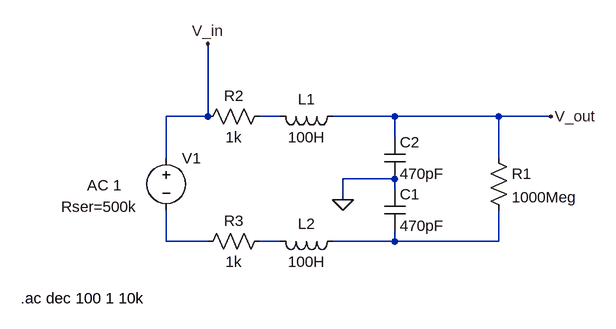
[diagram p0: schematic Filter_LC.asc]
Filter_LC.asc, the LTspice schematic file:
Version 4
SHEET 1 880 680
WIRE -80 96 -80 -16
WIRE -80 96 -144 96
WIRE 32 96 0 96
WIRE 208 96 112 96
WIRE 368 96 208 96
WIRE 448 96 368 96
WIRE 208 128 208 96
WIRE -144 160 -144 96
WIRE 368 160 368 96
WIRE 208 192 128 192
WIRE 208 208 208 192
WIRE 128 224 128 192
WIRE -144 288 -144 240
WIRE -80 288 -144 288
WIRE 32 288 0 288
WIRE 208 288 208 272
WIRE 208 288 112 288
WIRE 368 288 368 240
WIRE 368 288 208 288
FLAG 128 224 0
FLAG 448 96 V_out
FLAG -80 -16 V_in
SYMBOL cap 192 208 R0
SYMATTR InstName C1
SYMATTR Value 470pF
SYMBOL res 352 144 R0
SYMATTR InstName R1
SYMATTR Value 1000Meg
SYMBOL voltage -144 144 R0
WINDOW 123 -122 58 Left 2
WINDOW 39 -162 91 Left 2
SYMATTR Value2 AC 1
SYMATTR SpiceLine Rser=500k
SYMATTR InstName V1
SYMATTR Value ""
SYMBOL cap 192 128 R0
SYMATTR InstName C2
SYMATTR Value 470pF
SYMBOL ind 128 80 R90
WINDOW 0 5 56 VBottom 2
WINDOW 3 32 56 VTop 2
SYMATTR InstName L1
SYMATTR Value 100H
SYMBOL ind 128 272 R90
WINDOW 0 5 56 VBottom 2
WINDOW 3 32 56 VTop 2
SYMATTR InstName L2
SYMATTR Value 100H
SYMBOL res 16 80 R90
WINDOW 0 0 56 VBottom 2
WINDOW 3 32 56 VTop 2
SYMATTR InstName R2
SYMATTR Value 1k
SYMBOL res 16 272 R90
WINDOW 0 0 56 VBottom 2
WINDOW 3 32 56 VTop 2
SYMATTR InstName R3
SYMATTR Value 1k
TEXT -368 376 Left 2 !.ac dec 100 1 10k

The netlist it stands for:
* Filter_LC.asc
C1 0 N004 470pF
R1 V_out N004 1000Meg
V1 V_in N002 AC 1 Rser=500k
C2 V_out 0 470pF
L1 V_out N001 100H
L2 N004 N003 100H
R2 N001 V_in 1k
R3 N003 N002 1k
.ac dec 100 1 10k
.backanno
.end

* Results of the author's LTspice run, read from the files saved beside the schematic
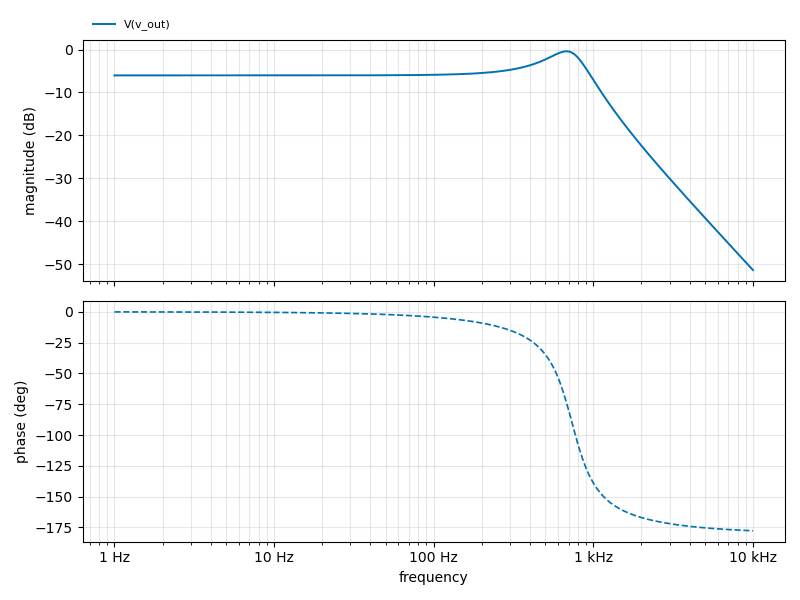
[diagram p1: AC Analysis of Filter_LC.asc, plotted from the saved traces]
* AC Analysis, 1 run:
*   V(v_out): -6.02 dB at 1 Hz, -51.35 dB at 10 kHz, peak -0.42 dB at 676.1 Hz, 3 dB below the peak at 420 Hz and 861.2 Hz